# Altium schematic sheet CON_SPDIF_IN.SchDoc: S/PDIF RCA Input
size A4; Organization: Altium Limited.; Address1: Level 3, 12a Rodborough Rd; Address2: Frenchs Forest 2086; Address3: NSW; Address4: AUSTRALIA; SheetNumber: 1; SheetTotal: 100
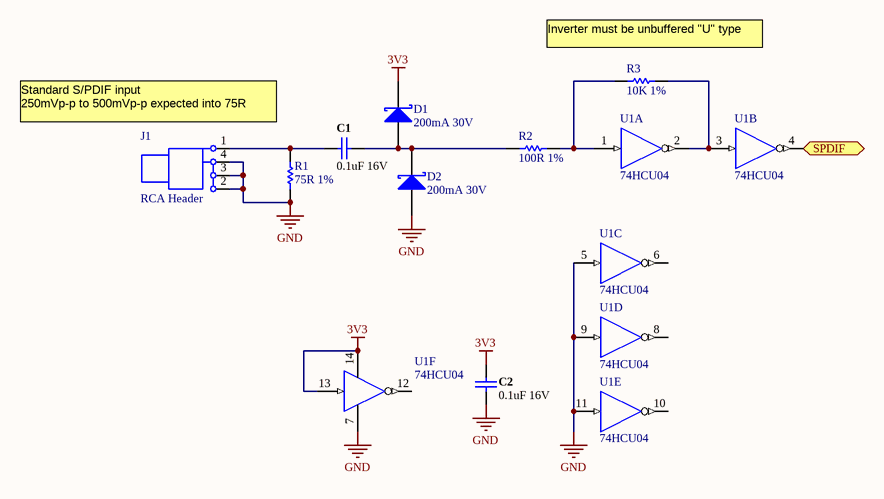
[diagram p0: CON_SPDIF_IN.SchDoc]

## Parts
C1  0.1uF 16V  [CAPC1005-STAR]
C2  0.1uF 16V  [CAPC1005-STAR]
D1  200mA 30V  [SOT95P230-3C]
D2  200mA 30V  [SOT95P230-3C]
J1  RCA Header  [TRC-005]
R1  75R 1%  [RESC1005-STAR]
R2  100R 1%  [RESC1005-STAR]
R3  10K 1%  [RESC1005-STAR]
U1  74HCU04  [SOIC127P600-14]  (parts A,B,C,D,E,F of 6)

## Ports
SPDIF (out)

## Nets
3V3: C2.2 D1.3(k) U1.13(A) U1.14(VCC)
GND: C2.1 D2.1(A) J1.2(Yellow) J1.3(White) J1.4(Red) R1.2 U1.5(A) U1.7(GND) U1.9(A) U1.11(A)
SPDIF: U1.4(Y) ; port SPDIF
NetC1_1: C1.1 J1.1(Black) R1.1
NetC1_2: C1.2 D1.1(A) D2.3(k) R2.2
NetR2_1: R2.1 R3.1 U1.1(A)
NetR3_2: R3.2 U1.2(Y) U1.3(A)

Not connected (* = marked no-connect by the designer): D1 2; D2 2; U1 6(Y) 8(Y) 10(Y) 12(Y)

## Notes on the sheet
- (near R3) Inverter must be unbuffered "U" type
- Standard S/PDIF input
  250mVp-p to 500mVp-p expected into 75R
- Sheet Title
- Project Title
- Size:
- Date:
- A4
- Assy:
- Time:
- Revision:
- Sheet
- of
- File:

## Library data of the parts
C1 C2 = D-101-0080: Capacitor, Ceramic, 0.1uF 10% 16V 0402 (1005) X7R; Polarity: Non-Polarized; Capacitance: 0.1 uF; Category: Capacitor; Dielectric: X7R; Mounting Technology: Surface Mount; Rated Voltage: 16 V; Status: Production; Technology: Ceramic; Tolerance: 10 %
D1 D2 = D-151-0002: Schottky Diode, BAT54 30V 200mA 30V SOT-23; Rated Voltage: 30 mV; Max Forward Current: 200 mA; Mounting Technology: Surface Mount; Status: Production; Category: Diode-Schottky
J1 = D-300-0051: Connector, TRC-005-4 , RCA Phono Jack, Right Angle, Thru-Hole, Snap-In; Max Current: mA; Connector type: Header; Mounting Technology: Through-Hole; Status: Unreleased; Category: Connector
R1 = D-100-0001: Resistor, 75R 1% 0402; Power Rating: 1/16 W; Mounting Technology: Surface Mount; Resistance: 75 R; Status: Production; Tolerance: 1 %; Category: Resistor
R2 = D-100-0131: Resistor, 100R 1% 0402 (1005); Power Rating: 63 mW; Mounting Technology: Surface Mount; Resistance: 100 R; Status: Production; Tolerance: 1 %; Category: Resistor
R3 = D-100-0130: Resistor, 10K 1% 0402 (1005); Power Rating: 63 mW; Mounting Technology: Surface Mount; Resistance: 10 K; Status: Production; Tolerance: 1 %; Category: Resistor
U1 = D-205-0010: 74HCU04, HEX Inverter, Unbuffered; Mounting Technology: Surface Mount; Status: Production; Category: IC-Logic